# Altium schematic sheet FPGA_AUDIO.SchDoc
size A4; SheetNumber: 7; SheetTotal: 8
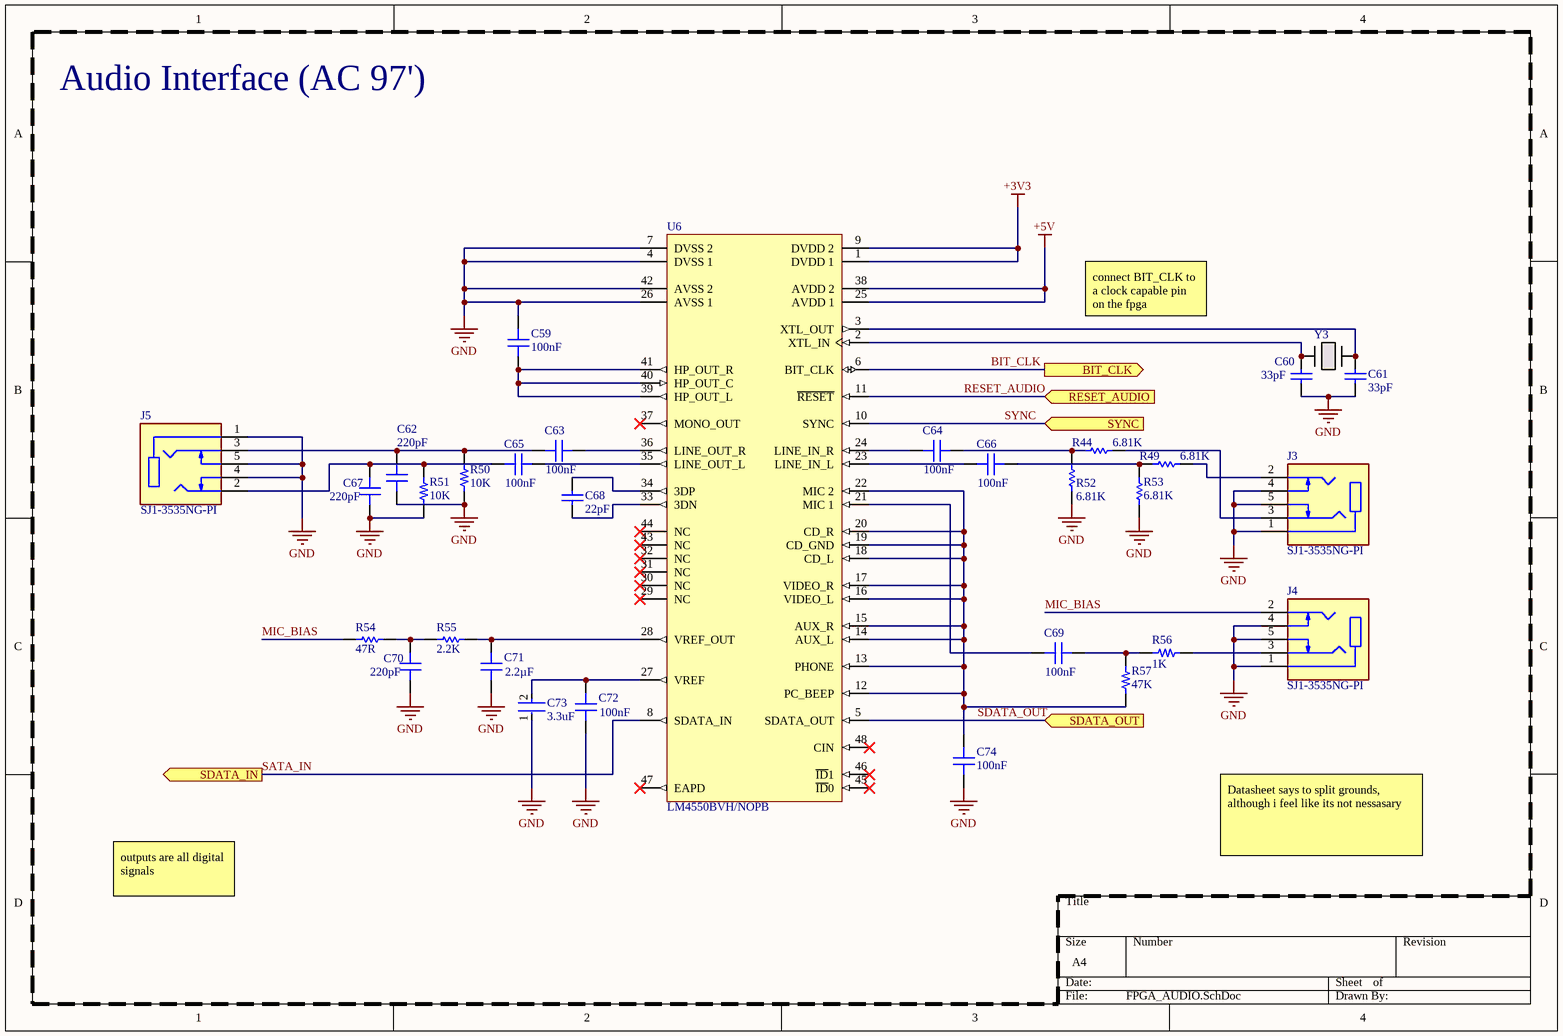
[diagram p0: FPGA_AUDIO.SchDoc]

## Parts
C59  Capacitance: 100nF  [CAP 0603_1608]  (hidden comment: CAP CER 0.1UF 100V 10% X7R 0603)
C60  33pF  [CAPC1005X55X25ML05T10]
C61  33pF  [CAPC1005X55X25ML05T10]
C62  Capacitance: 220pF  [CAP 0603_1608]  (hidden comment: CAP CER 220PF 50V 5% C0G/NP0 0603)
C63  Capacitance: 100nF  [CAP 0603_1608]  (hidden comment: CAP CER 0.1UF 100V 10% X7R 0603)
C64  Capacitance: 100nF  [CAP 0603_1608]  (hidden comment: CAP CER 0.1UF 100V 10% X7R 0603)
C65  Capacitance: 100nF  [CAP 0603_1608]  (hidden comment: CAP CER 0.1UF 100V 10% X7R 0603)
C66  Capacitance: 100nF  [CAP 0603_1608]  (hidden comment: CAP CER 0.1UF 100V 10% X7R 0603)
C67  Capacitance: 220pF  [CAP 0603_1608]  (hidden comment: CAP CER 220PF 50V 5% C0G/NP0 0603)
C68  22pF  [CAPC1005X55X25NL05T10]
C69  Capacitance: 100nF  [CAP 0603_1608]  (hidden comment: CAP CER 0.1UF 100V 10% X7R 0603)
C70  Capacitance: 220pF  [CAP 0603_1608]  (hidden comment: CAP CER 220PF 50V 5% C0G/NP0 0603)
C71  Capacitance: 2.2µF  [CAP 0603_1608]  (hidden comment: CAP CER 2.2UF 25V 10% X5R 0603)
C72  Capacitance: 100nF  [CAP 0603_1608]  (hidden comment: CAP CER 0.1UF 100V 10% X7R 0603)
C73  3.3uF  [FP-C1608-080-0_1-IPC_C]
C74  Capacitance: 100nF  [CAP 0603_1608]  (hidden comment: CAP CER 0.1UF 100V 10% X7R 0603)
J3  SJ1-3535NG-PI  [CUI_SJ1-3535NG-PI]
J4  SJ1-3535NG-PI  [CUI_SJ1-3535NG-PI]
J5  SJ1-3535NG-PI  [CUI_SJ1-3535NG-PI]
R44  6.81K  [RESC1005X40X25ML05T05]
R49  6.81K  [RESC1005X40X25ML05T05]
R50  10K  [RES 0603_1608]
R51  10K  [RES 0603_1608]
R52  6.81K  [RESC1005X40X25ML05T05]
R53  6.81K  [RESC1005X40X25ML05T05]
R54  47R  [RESC1608X55X30NL15T15]
R55  2.2K  [RESC1608X55X25LL10T15]
R56  1K  [RES 0603_1608]
R57  47K  [RES 0603_1608]
U6  LM4550BVH/NOPB  [PT0048A_L]
Y3  FOXSDLF245F-20  [CRYSTAL_HC49SDLF_FXT]  (value not drawn)

## Ports
BIT_CLK (out), RESET_AUDIO (in), SDATA_IN (out), SDATA_OUT (in), SYNC (in)

## Nets
+3V3: U6.1(DVDD_1) U6.9(DVDD_2)
+5V: U6.25(AVDD_1) U6.38(AVDD_2)
GND: C59.1 C60.2 C61.2 C62.2 C67.2 C70.2 C71.2 C72.2 C73.1 C74.2 J3.1 J3.4 J3.5 J4.1 J4.4 J4.5 J5.1 J5.4 J5.5 R50.2 R51.2 R52.1 R53.1 U6.4(DVSS_1) U6.7(DVSS_2) U6.26(AVSS_1) U6.42(AVSS_2)
BIT_CLK: U6.6(BIT_CLK) ; port BIT_CLK
MIC_BIAS: J4.2 R54.1
RESET_AUDIO: U6.11(~{RESET}) ; port RESET_AUDIO
SATA_IN: U6.8(SDATA_IN) ; port SDATA_IN
SDATA_OUT: U6.5(SDATA_OUT) ; port SDATA_OUT
SYNC: U6.10(SYNC) ; port SYNC
NetC59_2: C59.2 U6.39(HP_OUT_L) U6.40(HP_OUT_C) U6.41(HP_OUT_R)
NetC60_1: C60.1 U6.2(XTL_IN) Y3.2
NetC61_1: C61.1 U6.3(XTL_OUT) Y3.1
NetC62_1: C62.1 C63.1 J5.3 R50.1
NetC63_2: C63.2 U6.36(LINE_OUT_R)
NetC64_1: C64.1 U6.24(LINE_IN_R)
NetC64_2: C64.2 R44.1 R52.2
NetC65_1: C65.1 C67.1 J5.2 R51.1
NetC65_2: C65.2 U6.35(LINE_OUT_L)
NetC66_1: C66.1 U6.23(LINE_IN_L)
NetC66_2: C66.2 R49.1 R53.2
NetC68_1: C68.1 U6.34(3DP)
NetC68_2: C68.2 U6.33(3DN)
NetC69_1: C69.1 U6.21(MIC_1)
NetC69_2: C69.2 R56.1 R57.1
NetC70_1: C70.1 R54.2 R55.1
NetC71_1: C71.1 R55.2 U6.28(VREF_OUT)
NetC72_1: C72.1 C73.2 U6.27(VREF)
NetC74_1: C74.1 R57.2 U6.12(PC_BEEP) U6.13(PHONE) U6.14(AUX_L) U6.15(AUX_R) U6.16(VIDEO_L) U6.17(VIDEO_R) U6.18(CD_L) U6.19(CD_GND) U6.20(CD_R) U6.22(MIC_2)
NetJ3_2: J3.2 R49.2
NetJ3_3: J3.3 R44.2
NetJ4_3: J4.3 R56.2

Not connected (* = marked no-connect by the designer): U6 29(NC)* 30(NC)* 31(NC)* 32(NC)* 37(MONO_OUT)* 43(NC)* 44(NC)* 45(~{ID}0)* 46(~{ID}1)* 47(EAPD)* 48(CIN)*

## Notes on the sheet
- Audio Interface (AC 97')
- connect BIT_CLK to a clock capable pin on the fpga
- Datasheet says to split grounds, although i feel like its not nessasary
- outputs are all digital signals

## Library data of the parts
C59 C63-C66 C69 C72 C74 = CMP-013-0022-14: Ceramic Capacitor, Multilayer, Ceramic, 100V, 10% +Tol, 10% -Tol, X7R, 15% TC, 0.1uF, Surface Mount, 0603; Case/Package: 0603; Tolerance: 10%
C60 C61 = CMP-2008-03913-1: Part Number: GRM1555C1H330JA01D; Manufacturer: Murata
C62 C67 C70 = CMP-013-0101-6: 220pF ±5% 50V Ceramic Capacitor C0G, NP0 0603 (1608 Metric); Case/Package: 0603; Tolerance: 5%
C68 = CMP-2008-04302-1: Part Number: GRM1555C1H220JA01D; Manufacturer: Murata
C71 = CMP-013-0100-6: 2.2µF ±10% 25V Ceramic Capacitor X5R 0603 (1608 Metric); Tolerance: 10%; Case/Package: 0603
C73 = CMP-08246-004786-1: Multilayer Ceramic Capacitors 3.3μF ±10% 16V X5R SMD 0603; Max Operating Temperature: 85°C; Height: 0.8mm; Weight: 7.1E-05oz; Series: C; Construction: Flat; Capacitance: 3.3uF; Mount: Surface Mount; Voltage Rating (DC): 16V; Voltage Rating: 16V; Case Code (Imperial): 0603; Case Code (Metric): 1608; Min Operating Temperature: -55°C; Depth: 0.8mm; REACH SVHC: No SVHC; Package Quantity: 1; Case/Package: 0603; Tolerance: 10%; Packaging: Tape and Reel; Width: 0.031inch; RoHS Compliant: Yes; Thickness: 0.035inch; Lead Free: Lead Free; Length: 1.6mm; Dielectric Material: Ceramic; Radiation Hardening: No; Termination: SMD/SMT; Dielectric: X5R
J3-J5 = SJ1-3535NG-PI: 3.5 mm Right-Angle Stereo Jack, 5 pin PCB PCB Mount, Isolated Ground, Pink; Value: *; Availability: Unavailable; Price: None; Package: None; MP: SJ1-3535NG-PI
R44 R49 R52 R53 = CMP-2002-01038-1: Part Number: ERJ-2RKF6811X; Manufacturer: Panasonic
R50 R51 = CMP-009-00190-14: 10 ±1% 0.1W, 1/10W Chip Resistor 0603 (1608 Metric) Automotive AEC-Q200 Thick Film; Voltage Rating: 75V; Temperature Coefficient: 100ppm/°C; Case/Package: 0603
R54 = CMP-2000-00529-2: Chip Resistor, 47 Ohm, +/- 1%, 0.1 W, -55 to 155 degC, 0603 (1608 Metric), RoHS, Tape and Reel; Power Rating: 100 mW; Case\Package: 0603; Voltage Rating (DC): 50 V; Resistance: 6.8 kohm; Length: 1.6 mm; Case Code (Metric): 1608; Packaging: Tape and Reel; Min Operating Temperature: -55 degC; DatasheetVersion: Apr-15; PackageReference: 0603; Case Code (Imperial): 0603; PackageDescription: 2-Pin Surface Mount Device, Body 1.6 x 0.85 mm; Tolerance: 1%; Height: 0.45 mm; RoHSCompliant: true; ComponentLink2Description: Datasheet; Pins: 2; ComponentLink1URL: http://www.panasonic.com/; Package Quantity: 5000; REACH SVHC: No SVHC; ComponentLink2URL: http://industrial.panasonic.com/cdbs/www-data/pdf/RDA0000/AOA0000C86.pdf; Width: 0.8 mm; Mount: Surface Mount; Max Operating Temperature: 155 degC; ComponentLink1Description: Manufacturer URL; Voltage Rating: 50 V
R55 = CMP-2000-04211-1: Part Number: RC0603FR-132K2L; Manufacturer: Yageo
R56 = CMP-009-00014-17: 1 kOhms ±1% 0.1W, 1/10W Chip Resistor 0603 (1608 Metric) Moisture Resistant Thick Film; Temperature Coefficient: 100ppm/°C; Voltage Rating: 75V; Case/Package: 0603
R57 = CMP-010-0063-10: Fixed Resistor, Metal Glaze/thick Film, 0.1W, 47000ohm, 75V, 1% +/-Tol, 100ppm/Cel, Surface Mount, 0603; Temperature Coefficient: 100ppm/°C; Case/Package: 0603; Voltage Rating: 75V
U6 = CMP-0064-00035-3: AC '97 Rev 2.1 Codec with Sample Rate Conversion and National 3D Sound, 48-pin LQFP, Pb-Free; Manufacturer: Texas Instruments; PackageTopMarking: NSUZXYTT*LM4550*BVH; PowerWise: N; CompType: OtherParts; ComponentLink1Description: Datasheet URL; RoHS: Y; PackageDescription: LQFP, 7 x 7 x 1.4mm, 48 Lead, 0.5mm Pitch; PackageReference: PT0048A; PinCount: 48; ComponentLink1URL: http://www.ti.com/general/docs/lit/getliterature.tsp?genericPartNumber=LM4550B&fileType=pdf
Y3 = FOXSDLF245F-20: No Description Available; Mfr_Name: Fox